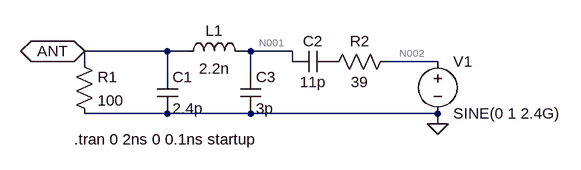
[diagram p0: schematic WiFi.asc]
WiFi.asc, the LTspice schematic file:
Version 4
SHEET 1 880 680
WIRE 64 64 -64 64
WIRE 96 64 64 64
WIRE 192 64 176 64
WIRE 256 64 192 64
WIRE -64 80 -64 64
WIRE 256 80 256 64
WIRE 480 80 400 80
WIRE 64 96 64 64
WIRE 192 96 192 64
WIRE 64 160 -64 160
WIRE 192 160 64 160
WIRE 480 160 192 160
WIRE 480 176 480 160
FLAG 480 176 0
FLAG -64 64 ANT
IOPIN -64 64 BiDir
SYMBOL voltage 480 64 R0
WINDOW 123 0 0 Left 0
WINDOW 39 0 0 Left 0
SYMATTR InstName V1
SYMATTR Value SINE(0 1 2.4G)
SYMBOL res -80 64 R0
SYMATTR InstName R1
SYMATTR Value 100
SYMBOL res 416 64 R90
WINDOW 0 0 56 VBottom 2
WINDOW 3 32 56 VTop 2
SYMATTR InstName R2
SYMATTR Value 39
SYMBOL cap 320 64 R90
WINDOW 0 0 32 VBottom 2
WINDOW 3 32 32 VTop 2
SYMATTR InstName C2
SYMATTR Value 11p
SYMBOL cap 48 96 R0
SYMATTR InstName C1
SYMATTR Value 2.4p
SYMBOL cap 176 96 R0
SYMATTR InstName C3
SYMATTR Value 3p
SYMBOL ind 80 80 R270
WINDOW 0 32 56 VTop 2
WINDOW 3 5 56 VBottom 2
SYMATTR InstName L1
SYMATTR Value 2.2n
TEXT -80 200 Left 2 !.tran 0 2ns 0 0.1ns startup

The netlist it stands for:
* WiFi.asc
V1 N002 0 SINE(0 1 2.4G)
R1 ANT 0 100
R2 N002 P001 39
C2 P001 N001 11p
C1 ANT 0 2.4p
C3 N001 0 3p
L1 ANT N001 2.2n
.tran 0 2ns 0 0.1ns startup
.backanno
.end

* Results of the author's LTspice run, read from the files saved beside the schematic
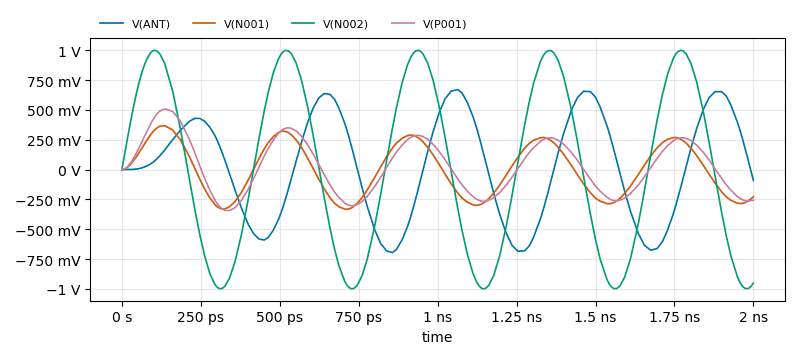
[diagram p1: Transient Analysis of WiFi.asc, plotted from the saved traces]
* Transient Analysis, 1 run:
*   V(ANT): min -695.5 mV, max 671.1 mV, average 29.12 mV, rms 439 mV, last -91.61 mV
*   V(N001): min -333.2 mV, max 368.1 mV, average 1.241 mV, rms 216.2 mV, last -227.9 mV
*   V(N002): min -999.7 mV, max 999.7 mV, average 22.82 mV, rms 712.1 mV, last -951.1 mV
*   V(P001): min -343.7 mV, max 509.6 mV, average 28.54 mV, rms 227 mV, last -256.3 mV